# Altium schematic sheet Power distribution for Noblemate Schematic Layout.SchDoc
size A4
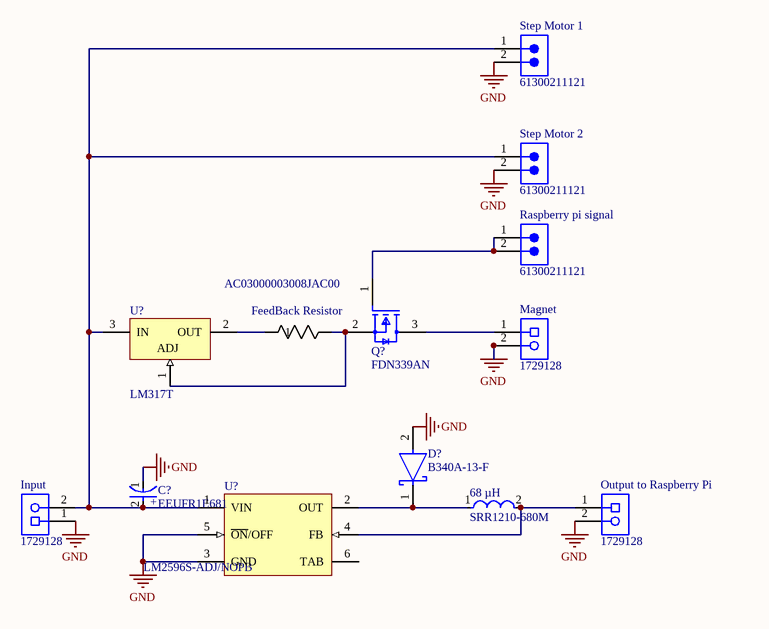
[diagram p0: Power distribution for Noblemate Schematic Layout.SchDoc]

## Parts
(Parts that share a designator on the sheet are numbered #1, #2 ... from top to bottom, then left to right.)
68_µH  SRR1210-680M  [FP-SRR1210-MFG]
C?  EEUFR1E681  [FP-RAD-TH-D_10_0_5-L_16_1-MFG]
D?  B340A-13-F  [FP-SMA-MFG]
FeedBack_Resistor  AC03000003008JAC00  [RES_AC03_VIS]
Input  1729128  [PHOE-1729128-2_V]
Magnet  1729128  [PHOE-1729128-2_V]
Output_to_Raspberry_Pi  1729128  [PHOE-1729128-2_V]
Q?  FDN339AN  [FP-527AG-MFG]
Raspberry_pi_signal  61300211121  [61300211121]
Step_Motor_1  61300211121  [61300211121]
Step_Motor_2  61300211121  [61300211121]
U?#1  LM317T  [NDE0003A]
U?#2  LM2596S-ADJ/NOPB  [KTT0005B_M]

## Nets
GND: C?.1(C) D?.2(A) Input.1 Magnet.2 Output_to_Raspberry_Pi.2 Step_Motor_1.2 Step_Motor_2.2 U?#2.3(GND) U?#2.5(~{ON}/OFF)
Net68_µH_1: 68_µH.1 D?.1(C) U?#2.2(OUT)
Net68_µH_2: 68_µH.2 Output_to_Raspberry_Pi.1 U?#2.4(FB)
NetC?_2: C?.2(A) Input.2 Step_Motor_1.1 Step_Motor_2.1 U?#1.3(IN) U?#2.1(VIN)
NetFeedBack_Resistor_1: FeedBack_Resistor.1 U?#1.2(OUT)
NetFeedBack_Resistor_2: FeedBack_Resistor.2 Q?.2(S) U?#1.1(ADJ)
NetMagnet_1: Magnet.1 Q?.3(D)
NetQ?_1: Q?.1(G) Raspberry_pi_signal.1 Raspberry_pi_signal.2

Not connected (* = marked no-connect by the designer): U?#2 6(TAB)

## Notes on the sheet
- (in symbol CMP-05427-001475-1) +

## Library data of the parts
68_µH = CMP-07248-000002-1: FIXED IND 68UH 3A 102 MOHM SMD; Manufacturer: Bourns; Shielding: true; Q Factor: 12; Series Resistance: 102mΩ; Saturation Current: 2.7A; Tolerance: 20%; Core Material: Ferrite; Self Resonant Frequency: 3.8MHz; Test Frequency: 2.52MHz; ComponentLink2Description: Datasheet; Inductance: 68uH; Rms Current: 3A; Device Class L3: Fixed Inductors; Lead Free: Yes; Composition: Wirewound; Value: 68uH; Temperature: -40°C to +125°C; Automotive: No; RoHS: TRUE; Category: Ind; Device Class L2: Inductors; Height: 10mm; Temperature Range Low: -40°C; Package: SRR1210; Device Class L1: Passive Components; Temperature Range High: +125°C; Mouser Description: Fixed Inductors 68uH 20% SMD 1210; ComponentLink2URL: https://www.bourns.com/docs/Product-Datasheets/SRR1210.pdf; Digikey Description: FIXED IND 68UH 3A 102 MOHM SMD; Octopart: https://octopart.com/srr1210-680m-bourns-10487145; Manufacturer Part Number: SRR1210-680M
C? = CMP-05427-001475-1: Aluminum Electrolytic Capacitors (Radial Lead Type) 680uF ±20% 25V
D? = CMP-1667-00003-3: DIODE SCHOTTKY 40V 3A SMA; Max Forward Surge Current (Ifsm): 80A; Forward Voltage: 500mV; Polarity: Standard; Max Reverse Current: 500uA; Capacitance: 250pF; Element Configuration: Single; Mount: Surface Mount; Output Current: 3A; Radiation Hardening: No; Width: 2.92mm; Current Rating: 3A; Termination: SMD/SMT; Voltage: 40V; Series: -; Max Operating Temperature: 125°C; Current: 3A; Max Repetitive Reverse Voltage (Vrrm): 40V; Min Operating Temperature: -55°C; REACH SVHC: No SVHC; Number of Pins: 2; Average Rectified Current: 3A; Contact Plating: Tin; RoHS Compliant: Yes; Max Reverse Voltage (DC): 40V; Packaging: Tape and Reel; Height: 2.3mm; Length: 4.6mm; Case/Package: SMA; Weight: 0.002258oz; Peak Non-Repetitive Surge Current: 80A; Package Quantity: 5000; Lead Free: Lead Free; Forward Current: 3A; Voltage Rating (DC): 40V
FeedBack_Resistor = CMP-00030-39747180-1: AC03000003008JAC00 Resistor, 3 Ohm, ± 5%, 3 W, Axial Leaded, Wirewound, General Purpose; Voltage Rating: 3V; Temperature Coefficient: -80ppm/°C; Resistance: 3Ω; Max Power Dissipation: 3W; Lead Diameter: 800µm; Schedule B: 8533210080, 8533210080; Radiation Hardening: No; Features: Flame Retardant Coating; Case/Package: Axial; REACH SVHC: Unknown; Termination: Axial; Diameter: 4.8mm; Width: 4.8mm; Power Rating: 3W; Number of Pins: 2; Tolerance: 5%; Voltage Rating (DC): 3V; Length: 13mm; Min Operating Temperature: -40°C; Composition: Wirewound; NexarPartId: 39747180; Packaging: Tape & Box (TB); Max Operating Temperature: 275°C; Number of Terminations: 2; Thickness: 4.8006mm; RoHS: Compliant; Contact Plating: Tin
Input Magnet Output_to_Raspberry_Pi = CMP-2000-05815-1: PCB Terminal Block, 13.5 A, 400 V, 2-Pin THD, RoHS, Bulk; Manufacturer: Phoenix Contact; Package Version: 03/2015; No. of Rows: 1; Pitch: 5.08mm; No. of Positions: 2; Voltage Rating: 400V; Current Rating: 13500mA; Manufacturer URL: http://www.phoenixcontact.com/; Datasheet URL: https://datasheet.ciiva.com/16046/1729128-16046181.pdf; RoHS: TRUE; Package URL: https://www.phoenixcontact.com/online/portal/pi/pxc/product_detail_page/!ut/p/b1/3VdJjqNKFDxLH8AFycySyWY2ozFsEPOMMQaDOX1XedGL_1Vdm5YXJleknhSKeBkvI6EA8ncAo3AYoDhBQGco6KN7VURTdemj9us_IEKEZo_YHiPAEWEFmDGOHMORkqKYCORBZxgL7ZoaZYcbFFUZ3fqxSY6GOuxydWUuHqz1ynmMFygu583Bob0Ewr6Sd_l-5m-kAueHiB0jpRwZwe58wwtkpxtMYd_LmGcDRU02dRNEyWt6Y2ti5pSyJ_reIkzIulrqApdnbT11V5jnCKbYNCvhEM1MCpPByat_X379-iThf08CI5GfOPqfBeS3BRoBOdD55AKVv0iLwCMq-2BrzXWSGRH7pUGD9uwXQjiph3xL0DKQwdGa0JImiIOmBNOestqgwTHSSs2oOep-78apyXQBvNi8ZLaFjvjWvcaUEBu0MC6Wbe-d6mB0FAebo2lUWinqYaZs5DAYzV0RP9yitUjnGJ0iI9xhZkT42OCQNUJJhkgWINNQLP2JFP6OpMg3JCVg70jqHT0lvKOnhHf0lPuOnnLf0VPuWx6_dxwUIvwk5WMkT0kLL1mh61l2yZVSzG3pYV_bqo-mj6uMKwKwdnnW8Jh5RTOJzMOA5c-eJDaZQw4mTMPH02PvS_ZAqNVjVTo2WyYLkwH_KU1mmmG5kjRhDqPXLwwVHvVOjCM60-fpXvTDfMGW1PVFVS1r4e4yVDk4ZdNbkUHvqPqQSeian4UD39fNKmachqdJ1NJbyk8rXT9mXTvPk3oE5meulKGgiruPJek-4I9hTT6G8ZLOyRSm2RRVbThERQad5OS28hdt4YW4vG0stgYYzsWsK4_7y6DZMjJSCqri1kyiZR5vD7pwIrNR7QwPHTcLTI5qT7eRlpHrdGiupYlqQDJ7zy_CND8fWWBoLRXxk1RVcXiBQwbTD4Xi7KL-FuO94t9xaqweXzH; PartNumber: 1729128; Package Description: 2-Pin Through Hole Device, Body 8.1 x 10.16 mm, Pitch 5.08 mm; Datasheet Version: 12/2013; Mounting Technology: ThroughHole; Orientation: Horizontal; Package Reference: 1729128-2; Packing: Bulk
Q? = CMP-2000-06252-2: MOSFET N-CH 20V 3A SSOT3; Nominal Vgs: 850mV; Drain to Source Resistance: 29mR; Rds On Max: 35mR; Rise Time: 10ns; Gate to Source Voltage (Vgs): 8V; Element Configuration: Single; Number of Elements: 1; Input Capacitance: 700pF; Power Dissipation: 500mW; Turn-On Delay Time: 8ns; Turn-Off Delay Time: 18ns; Termination: SMD/SMT; Mount: Surface Mount; Radiation Hardening: No; Max Operating Temperature: 150°C; Drain to Source Voltage (Vdss): 20V; Continuous Drain Current (ID): 3A; REACH SVHC: No SVHC; Current Rating: 3A; Packaging: Tape and Reel; Case/Package: TO-236-3; On-State Resistance: 35mR; Number of Pins: 3; Threshold Voltage: 850mV; Width: 1.4mm; Height: 0.94mm; Fall Time: 10ns; Voltage Rating (DC): 20V; Length: 2.92mm; Package Quantity: 1; Weight: 0.03g; Min Operating Temperature: -55°C; Drain to Source Breakdown Voltage: 20V; Lead Free: Lead Free; Max Power Dissipation: 500mW; Dual Supply Voltage: 20V
Raspberry_pi_signal Step_Motor_1 Step_Motor_2 = CMP-1712-00002-6: NexarPartId: 20081794; Number of Contacts: 2; Pitch: 2.54mm; Connector Type: Male Pin; Voltage Rating: 250V; Current Rating: 3A; Gender: Male; Contact Resistance: 20mΩ; Height: 8.94mm; Lead Free: Lead Free; Number of Pins: 2; Termination: Through Hole; RoHS: Compliant; Lead Pitch: 2.54mm; REACH SVHC: No SVHC; Housing Material: PBT; Contact Mating Length: 5.9944mm; Min Operating Temperature: -40°C; Orientation: Vertical; Contact Material: Copper; Contact Gender: Male; Max Operating Temperature: 125°C; Number of Rows: 1; Number of Positions: 2; Packaging: Bulk; Contact Plating: Gold; Mount: Through Hole; Color: Black; Operating Supply Voltage: 250V
U?#1 = CMP-0062-02456-3: 3-Terminal Adjustable Regulator, 3-pin TO-220; Manufacturer: Texas Instruments; CompType: LDO IC; PowerWise: N; PackageTopMarking: NSUZXYTTE#*LM317T P+; ComponentLink1Description: Datasheet URL; PackageReference: NDE0003A; PinCount: 3; ComponentLink1URL: http://www.ti.com/general/docs/lit/getliterature.tsp?genericPartNumber=LM317-N&fileType=pdf; RoHS: N; PackageDescription: TO-220, Molded, 3 Lead, Straight
U?#2 = CMP-0069-00271-3: SIMPLE SWITCHER® Power Converter 150 KHz 3A Step-Down Voltage Regulator, 5-pin TO-263, Pb-Free; Manufacturer: Texas Instruments; PowerWise: N; PackageTopMarking: NSUZXYTTE#*LM2596S*-ADJ P+; ComponentLink1Description: Datasheet URL; PackageDescription: TO-263, Molded, .400 x .390 x .180in, 5 Lead, .067in Pitch, Surface Mount; ComponentLink1URL: http://www.ti.com/general/docs/lit/getliterature.tsp?genericPartNumber=LM2596&fileType=pdf; Code_JEDEC: MO-169-AB; PinCount: 5; CompType: Switcher; PackageReference: KTT0005B; RoHS: Y